# EAGLE design 15321^3 (EAGLE 7.6.0)
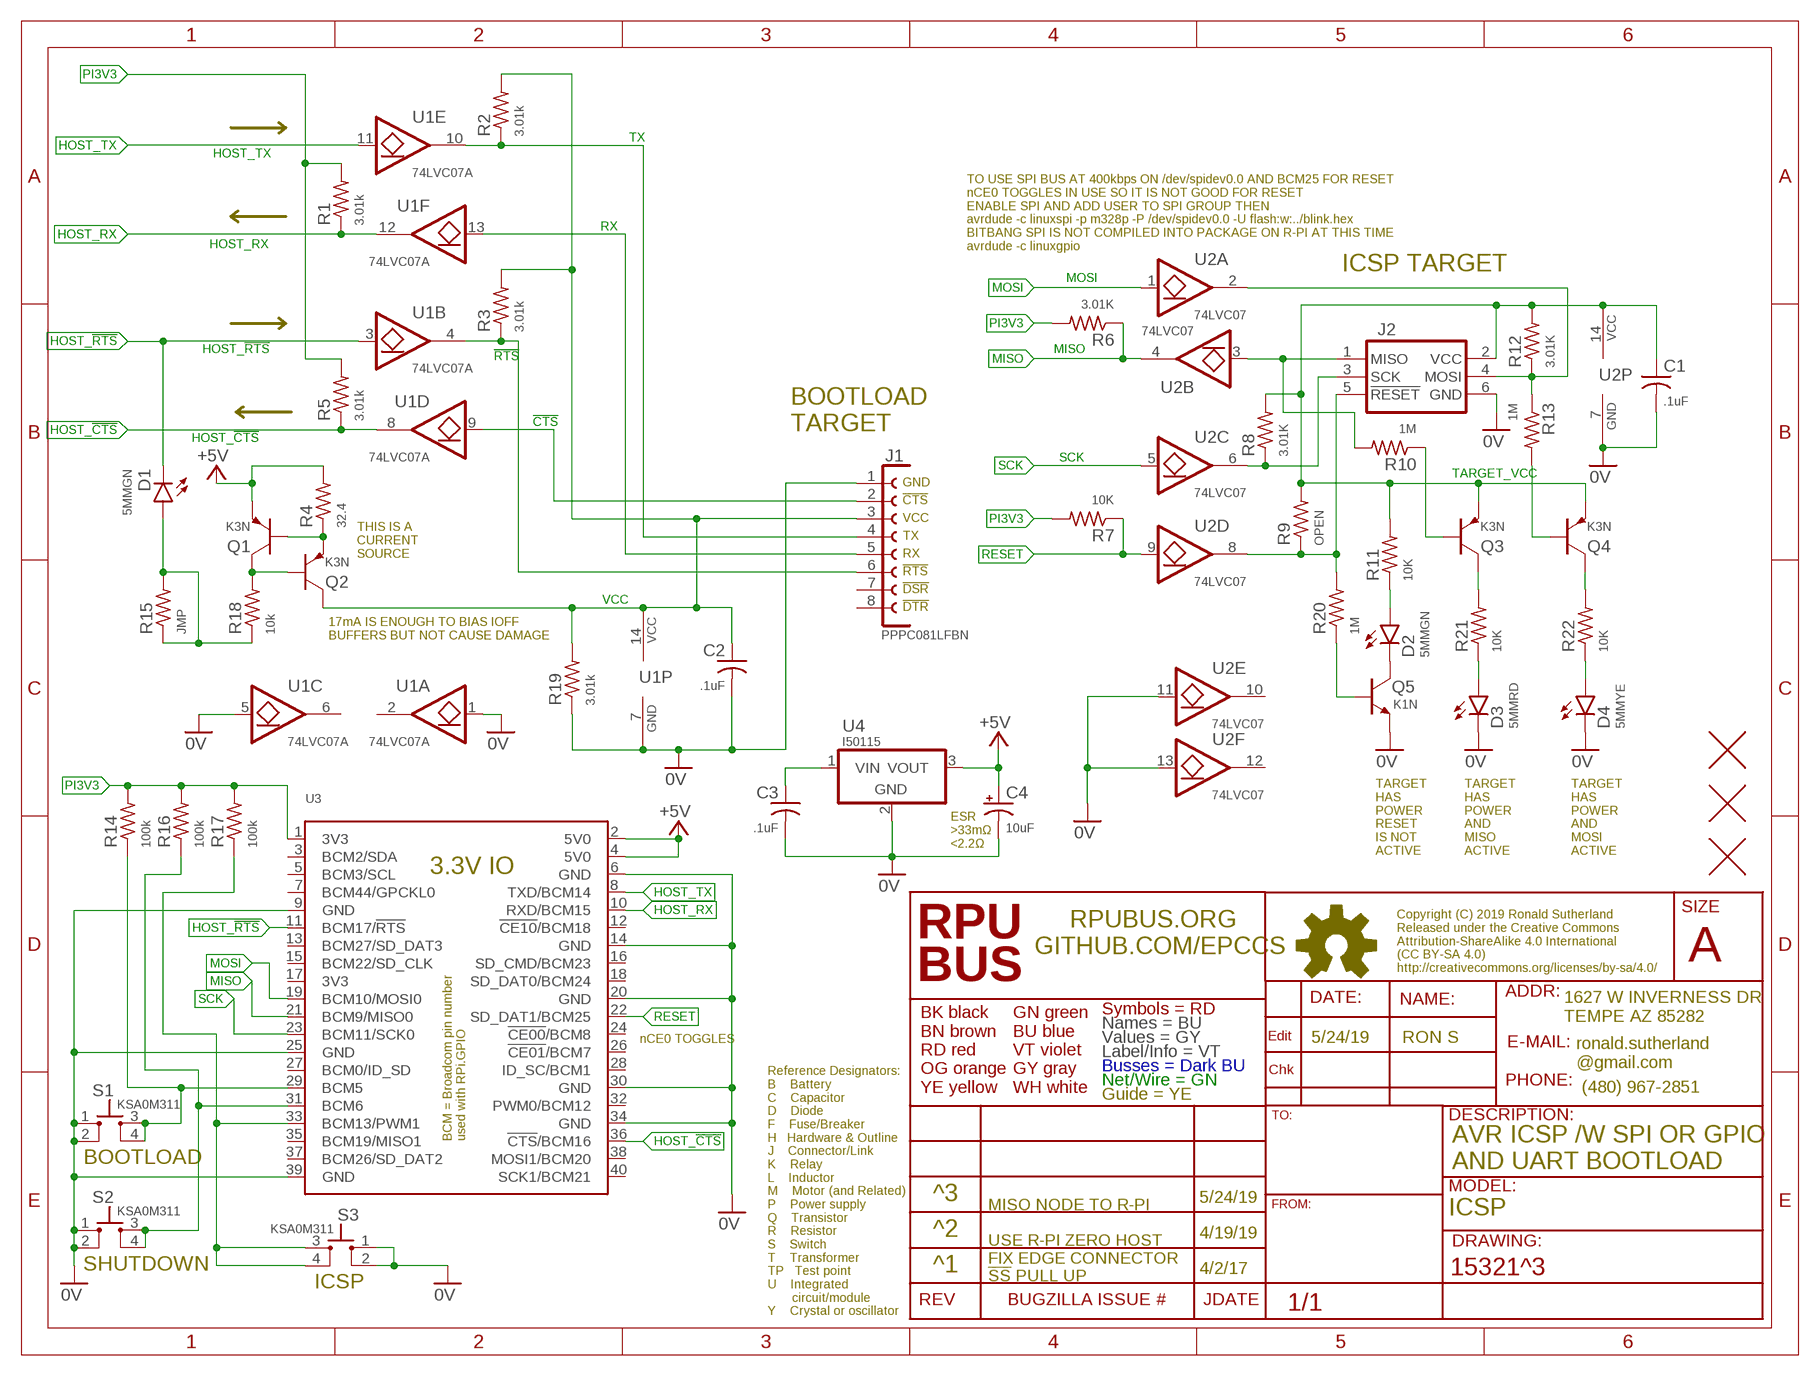
[diagram p0: schematic, sheet 1]

## Parts
C1  .1uF  CC0603A  [C0603(1608)]
C2  .1uF  CC0603A  [C0603(1608)]
C3  .1uF  CC0603A  [C0603(1608)]
C4  10uF  CT1206  [3216]
D1  5MMGN  LED5MM  [LED5MM]
D2  5MMGN  LED5MM  [LED5MM]
D3  5MMRD  LED5MM  [LED5MM]
D4  5MMYE  LED5MM  [LED5MM]
J1  PPPC081LFBN  F1X8  [F1X8]
J2  ISP-SPIEDG  [ISP-EDG]
Q1  K3N  PNPSOT23  [SOT23]
Q2  K3N  PNPSOT23  [SOT23]
Q3  K3N  PNPSOT23  [SOT23]
Q4  K3N  PNPSOT23  [SOT23]
Q5  K1N  NPNSOT23  [SOT23]
R1  3.01k  R0805  [C0805(2012)]
R2  3.01k  R0805  [C0805(2012)]
R3  3.01k  R0805  [C0805(2012)]
R4  32.4  R0805  [C0805(2012)]
R5  3.01k  R0805  [C0805(2012)]
R6  3.01K  R0805  [C0805(2012)]
R7  10K  R0805  [C0805(2012)]
R8  3.01K  R0805  [C0805(2012)]
R9  OPEN  R0805  [C0805(2012)]
R10  1M  R0805  [C0805(2012)]
R11  10K  R0805  [C0805(2012)]
R12  3.01K  R0805  [C0805(2012)]
R13  1M  R0805  [C0805(2012)]
R14  100k  R0805  [C0805(2012)]
R15  JMP  R0805  [C0805(2012)]
R16  100k  R0805  [C0805(2012)]
R17  100k  R0805  [C0805(2012)]
R18  10k  R0805  [C0805(2012)]
R19  3.01k  R0805  [C0805(2012)]
R20  1M  R0805  [C0805(2012)]
R21  10K  R0805  [C0805(2012)]
R22  10K  R0805  [C0805(2012)]
S1  KSA0M311  [0M311]
S2  KSA0M311  [0M311]
S3  KSA0M311  [0M311]
U1  74LVC07A  7407D  [14SOIC]
U2  74LVC07  7407D  [14SOIC]
U3  RPI-ZERO  [RASPI_ZERO_H40PIN]
U4  I50115  OKI-78SR-H  [OKI-78SR-H]
U$2  FIDUCIAL1.27  [FIDUCIAL-1.27]
U$3  FIDUCIAL1.27  [FIDUCIAL-1.27]
U$4  FIDUCIAL1.27  [FIDUCIAL-1.27]

## Nets
0V: C1.2 C2.2 C3.2 C4.- D3.K D4.K J1.1 J2.6(GND) Q5.E R19.1 S1.1 S1.2 S2.1 S2.2 S3.1 S3.2 U1.1(A:I) U1.5(C:I) U1.7(P:GND) U2.7(P:GND) U2.11(E:I) U2.13(F:I) U3.6(GND) U3.9(GND) U3.14(GND) U3.20(GND) U3.25(GND) U3.30(GND) U3.34(GND) U3.39(GND) U4.2(GND)
!CTS: J1.2 U1.9(D:I)
!RST: J2.5(!RESET) R9.1 R20.2 U2.8(D:O)
!RTS: J1.6 R3.1 U1.4(B:O)
+5V: C4.+ Q1.E R4.2 U3.2(5V0) U3.4(5V0) U4.3(VOUT)
HOST_!CTS: R5.1 U1.8(D:O) U3.36(!CTS!/BCM16)
HOST_!RTS: D1.K U1.3(B:I) U3.11(BCM17/!RTS!)
HOST_RX: R1.1 U1.12(F:O) U3.10(RXD/BCM15)
HOST_TX: U1.11(E:I) U3.8(TXD/BCM14)
MISO: R6.1 U2.4(B:O) U3.21(BCM9/MISO0)
MOSI: U2.1(A:I) U3.19(BCM10/MOSI0)
N$1: J2.3(SCK) R8.1 U2.6(C:O)
N$2: D4.A R22.1
N$3: J2.1(MISO) R10.2 U2.3(B:I)
N$4: J2.4(MOSI) R12.1 R13.1 U2.2(A:O)
N$5: Q4.C R22.2
N$6: D3.A R21.1
N$7: Q3.C R21.2
N$8: Q1.B Q2.E R4.1
N$9: Q1.C Q2.B R18.2
N$10: D1.A R15.1 R15.2 R18.1
N$11: Q5.B R20.1
N$12: D2.K Q5.C
N$13: R14.1 S1.3 S1.4 U3.29(BCM5)
N$14: R16.1 S2.3 S2.4 U3.31(BCM6)
N$15: R17.1 S3.3 S3.4 U3.33(BCM13/PWM1)
N$16: D2.A R11.1
N$17: Q4.B R13.2
N$18: Q3.B R10.1
PI3V3: R1.2 R5.2 R6.2 R7.2 R14.2 R16.2 R17.2 U3.1(3V3)
RESET: R7.1 U2.9(D:I) U3.22(SD_DAT1/BCM25)
RX: J1.5 U1.13(F:I)
SCK: U2.5(C:I) U3.23(BCM11/SCK0)
TARGET_VCC: C1.1 J2.2(VCC) Q3.E Q4.E R8.2 R9.2 R11.2 R12.2 U2.14(P:VCC)
TX: J1.4 R2.1 U1.10(E:O)
VCC: C2.1 J1.3 Q2.C R2.2 R3.2 R19.2 U1.14(P:VCC)
VIN: C3.1 U4.1(VIN)
Unconnected: J1.7 J1.8 U1.2(A:O) U1.6(C:O) U2.10(E:O) U2.12(F:O) U3.3(BCM2/SDA) U3.5(BCM3/SCL) U3.7(BCM44/GPCKL0) U3.12(!CE10!/BCM18) U3.13(BCM27/SD_DAT3) U3.15(BCM22/SD_CLK) U3.16(SD_CMD/BCM23) U3.17(3V3) U3.18(SD_DAT0/BCM24) U3.24(!CE00!/BCM8) U3.26(!CE01!/BCM7) U3.27(BCM0/ID_SD) U3.28(ID_SC/BCM1) U3.32(PWM0/BCM12) U3.35(BCM19/MISO1) U3.37(BCM26/SD_DAT2) U3.38(MOSI1/BCM20) U3.40(SCK1/BCM21)

## Notes on the sheet
- TO USE SPI BUS AT 400kbps ON /dev/spidev0.0 AND BCM25 FOR RESET
  nCE0 TOGGLES IN USE SO IT IS NOT GOOD FOR RESET
  ENABLE SPI AND ADD USER TO SPI GROUP THEN
  avrdude -c linuxspi -p m328p -P /dev/spidev0.0 -U flash:w:../blink.hex 
  BITBANG SPI IS NOT COMPILED INTO PACKAGE ON R-PI AT THIS TIME
  avrdude -c linuxgpio
- ICSP TARGET
- BOOTLOAD
  TARGET
- GND
- !CTS
- VCC
- TX
- THIS IS A 
  CURRENT 
  SOURCE
- RX
- !RTS
- !DSR
- !DTR
- 17mA IS ENOUGH TO BIAS IOFF 
  BUFFERS BUT NOT CAUSE DAMAGE
- ESR
  >33mΩ
  <2.2Ω
- TARGET
  HAS
  POWER
  RESET 
  IS NOT 
  ACTIVE
- TARGET
  HAS
  POWER
  AND
  MISO 
  ACTIVE
- TARGET
  HAS
  POWER
  AND
  MOSI
  ACTIVE
- nCE0 TOGGLES | 5/24/19 | RON S
- BOOTLOAD
- AVR ICSP /W SPI OR GPIO
  AND UART BOOTLOAD
- ^3 | 5/24/19
- MISO NODE TO R-PI
- ICSP
- ^2 | 4/19/19
- USE R-PI ZERO HOST
- SHUTDOWN | ^1 | 4/2/17
- FIX EDGE CONNECTOR
  !SS! PULL UP
- ICSP

## Library data of the parts
C1-C3 = C-C:C: CAPACITOR Symbol
C4 = C-T:CT: Tantalum Electrolytic Capacitor
D1-D4 = D-LED:LED: LED 120120WH [CREE,XHGAWT-00-0000-00000HXE1] LED WHITE 6500K 150LUM-W120120
J1 = J-HDR2.54mm:F1X8: FEMALE HEADER 8POS
J2 = U-AVR:ISP-SPI: AVR ISP thru SPI In-System Programming uses the target Atmel AVR’s internal SPI (Serial Peripheral Interface) to download code into the flash and EEPROM memories. It is not a debugging interface. When designing an application PCB which includes an AVR with the SPI interface, this pinout should be used. Sparkfun SKU: BOB-08508
Q1-Q4 = Q-PNP:PNP: BJT NPN General Purpose Amplifier
Q5 = Q-NPN:NPN: BJT NPN General Purpose Amplifier
R1-R22 = R-C:R: Resiistor American-style symbol
S1-S3 = S-Tactile:KSA: KSA0M311 [C&K,KSA0M311LFT] SWITCH TACTILE SEALED SPST-NO 50MA 32V
U1 U2 = U-7400:74*07: HEX BUFFER, OPEN DRAIN/COLLECTOR 74LVC07A [DIODES,74LVC07AS14-13] LOGIC BUFFER OPEN DRAIN 14SOIC
U3 = U-Pi:RPI-ZERO: Raspberry Pi Zero https://pinout.xyz/ NOTE: WiFi is needed see https://www.kickstarter.com/projects/1991736672/iot-hat-for-raspberry-pi-a-must-have-for-pi-zero
U4 = P-DCDC:OKI-78SR: OKI-78SR OKI-78SR-5/1.5-W36H-C 5V@1.5A Horizontal Mount OKI-78SR-5/1.5-W36-C 5V@1.5A Vert Mount OKI-78SR-3.3/1.5-W36H-C 3.3V@1.5A Horizontal Mount OKI-78SR-3.3/1.5-W36-C 3.3V@1.5A Vert Mount Murata Power Solutions 7 to 36 VDC input range need to verify pinout
U$2-U$4 = H-Fiducial:FIDUCIAL: Fiducial Alignment Points Various fiducial points for machine vision alignment.

## Net classes
0 default: width 0.178 mm, drill 0.33 mm

## Board
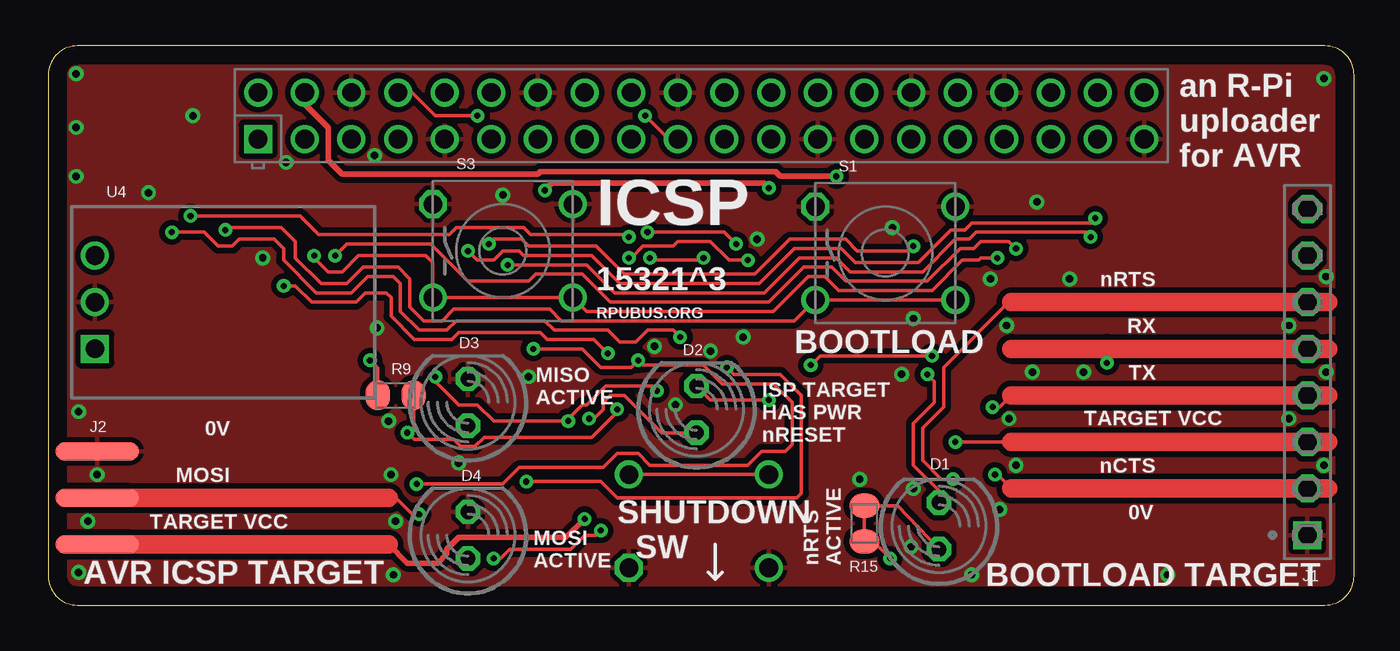
[diagram p1: board, top side]
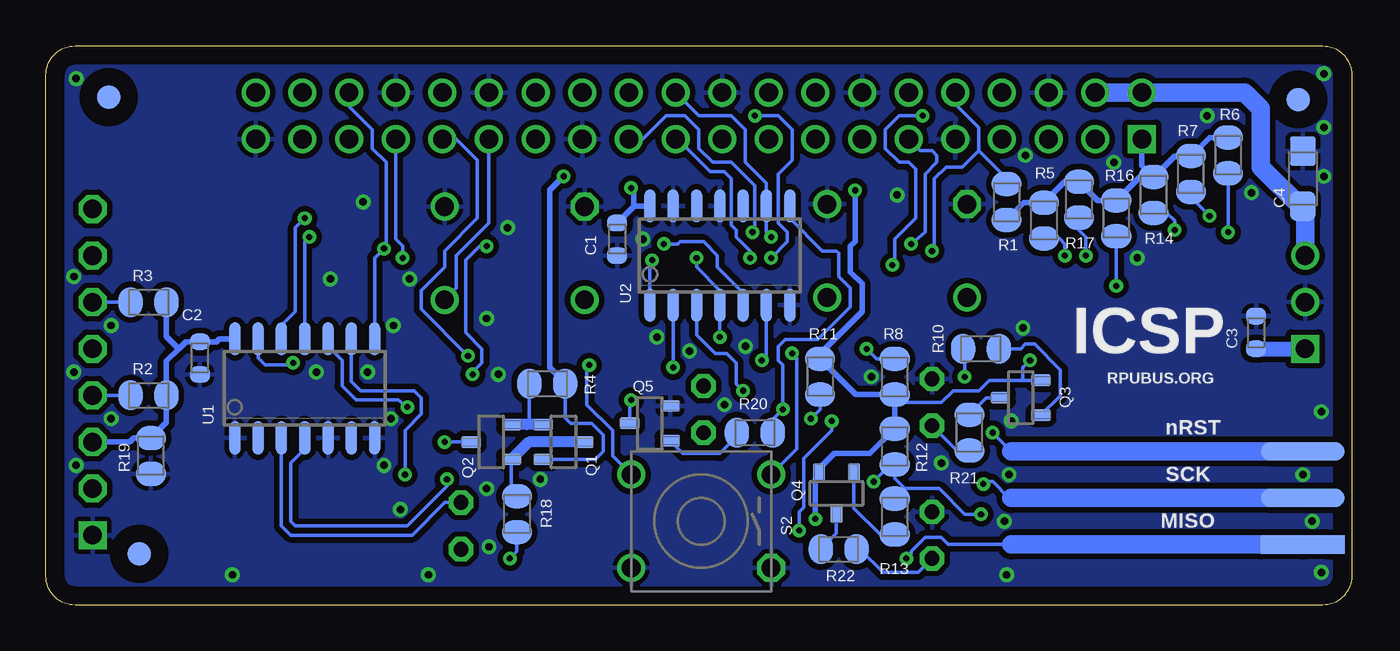
[diagram p2: board, bottom side, seen from below]

Size 71.12 x 30.48 mm. Coordinates in mm from the lower left corner, seen from the top.
Outline: 0,28.89 0,1.59 arc90 1.59,0 69.53,0 arc90 71.12,1.59 71.12,28.89 arc90 69.53,30.48 1.59,30.48 arc90 0,28.89
Copper layers (1*16): Top 0.035mm / dielectric 1.5mm / Bottom 0.035mm
Design rules "default *": minimum track width 10mil, minimum drill 13mil, track to track 10mil, track to pad 10mil, pad to pad 10mil, via to via 10mil, smd to smd 8mil, copper to edge 40mil, drill to drill 8mil, minimum pad ring 10mil, minimum via ring 8mil, stop-mask expansion 4mil, vias tented up to drill 17mil, thermal gap 10mil

### Footprints (pad centres in the part's own frame; a part is rotated, then mirrored left to right if it is on the bottom)
C0603(1608) = smd 0.898 x 1.1: 1 -0.889,0; 2 0.889,0
3216 = smd 1.6 x 1.4: + -1.5,0; - 1.5,0
LED5MM = drill 0.813 octagon: A -1.27,0; K 1.27,0
F1X8 = drill 1.016 square: 1 0,0 | drill 1.016 octagon: 2 2.54,0; 3 5.08,0; 4 7.62,0; 5 10.16,0; 6 12.7,0; 7 15.24,0; 8 17.78,0
ISP-EDG = smd 1.016 x 4.572 bottom: 1 -2.54,2.286; 3 0,2.286; 5 2.54,2.286 | smd 1.016 x 4.572: 2 -2.54,2.286; 4 0,2.286; 6 2.54,2.286
SOT23 = smd 0.65 x 1.06: B -0.95,-1.1; C 0,1.1; E 0.95,-1.1
C0805(2012) = smd 1.321 x 1.651: 1 -0.977,0; 2 0.977,0
0M311 = drill 1.016 octagon: 1 -3.81,2.54 | drill 1.016: 2 3.81,2.54; 3 -3.81,-2.54; 4 3.81,-2.54
14SOIC = smd 0.6 x 1.8: 1 -3.81,-2.7; 2 -2.54,-2.7; 3 -1.27,-2.7; 4 0,-2.7; 5 1.27,-2.7; 6 2.54,-2.7; 7 3.81,-2.7; 8 3.81,2.7; 9 2.54,2.7; 10 1.27,2.7; 11 0,2.7; 12 -1.27,2.7; 13 -2.54,2.7; 14 -3.81,2.7
RASPI_ZERO_H40PIN = drill 1.016 square: 1 0,0 | drill 1.016: 2 0,2.54; 3 2.54,0; 4 2.54,2.54; 5 5.08,0; 6 5.08,2.54; 7 7.62,0; 8 7.62,2.54; 9 10.16,0; 10 10.16,2.54; 11 12.7,0; 12 12.7,2.54; 13 15.24,0; 14 15.24,2.54; 15 17.78,0; 16 17.78,2.54; 17 20.32,0; 18 20.32,2.54; 19 22.86,0; 20 22.86,2.54; 21 25.4,0; 22 25.4,2.54; 23 27.94,0; 24 27.94,2.54; 25 30.48,0; 26 30.48,2.54; 27 33.02,0; 28 33.02,2.54; 29 35.56,0; 30 35.56,2.54; 31 38.1,0; 32 38.1,2.54; 33 40.64,0; 34 40.64,2.54; 35 43.18,0; 36 43.18,2.54; 37 45.72,0; 38 45.72,2.54; 39 48.26,0; 40 48.26,2.54
OKI-78SR-H = drill 1.016 square: 1 0,0 | drill 1.016: 2 -2.54,0; 3 -5.08,0
FIDUCIAL-1.27 = smd 1.27 x 1.27: 1 0,0

### Placement (x,y rotation side)
C1  40.01,19.94 270 bottom
C2  62.74,13.46 270 bottom
C3  5.21,14.86 90 bottom
C4  2.67,23.24 90 bottom
D1  48.51,4.32 90 top
D2  35.31,10.67 90 top
D3  22.86,11.05 90 top
D4  22.86,3.81 90 top
J1  68.58,3.81 90 top
J2  4.95,5.84 90 top
Q1  42.93,8.89 270 bottom
Q2  46.86,8.89 90 bottom
Q3  18.03,11.3 90 bottom
Q4  28.07,6.1 180 bottom
Q5  38.23,9.91 90 bottom
R1  18.8,21.97 270 bottom
R2  65.53,11.43 0 bottom
R3  65.53,16.51 0 bottom
R4  43.81,12.06 0 bottom
R5  16.76,20.95 90 bottom
R6  6.73,24.51 90 bottom
R7  8.76,23.5 90 bottom
R8  24.89,12.45 270 bottom
R9  18.92,11.43 180 top
R10  20.19,13.97 180 bottom
R11  28.96,12.45 90 bottom
R12  24.89,8.64 90 bottom
R13  24.89,4.83 270 bottom
R14  10.79,22.35 90 bottom
R15  44.45,4.45 90 top
R16  12.83,21.08 90 bottom
R17  14.86,22.1 90 bottom
R18  45.47,4.95 90 bottom
R19  65.41,8.13 90 bottom
R20  32.51,9.4 0 bottom
R21  20.83,9.4 90 bottom
R22  27.94,3.05 180 bottom
S1  45.59,19.18 0 top
S2  35.43,4.57 180 bottom
S3  24.77,19.3 0 top
U1  57.02,11.81 0 bottom
U2  34.42,19.05 0 bottom
U3  11.43,25.4 0 top
U4  2.54,13.97 270 top
U$2  2.92,27.56 0 bottom
U$3  67.69,27.69 0 bottom
U$4  66.04,2.79 0 bottom

### Tracks (layer width: path | path; a pad name or v marks a point on that pad's centre or on a via)
0V  (via drill 0.41)
  other vias: 60.96,1.65 1.65,1.78 2.67,7.11 69.47,7.62 67.56,10.16 69.6,12.7 67.56,15.24 69.6,17.91 52.2,15.24 53.59,12.7 56.39,12.7 52.7,7.62 52.32,10.16 55.63,17.78 2.16,4.57 18.54,10.03 1.52,28.96 69.47,28.7 17.91,15.11 11.68,18.92 5.46,22.48 7.87,26.67 12.95,24.13 17.78,24.51 24.77,22.35 33.02,14.1 34.16,10.92 22.35,7.75 18.67,7.11 18.92,4.57 18.8,1.65 44.2,6.86 46.99,3.17 51.82,5.21 50.29,1.65 46.48,12.57 47.12,15.62 51.31,17.78 45.97,20.57 53.85,21.97 36.07,13.84 37.85,14.61 47.12,6.35 26.16,12.45 38.61,19.94 1.65,10.54 1.52,26.04 1.52,23.37
  pour Bottom (isolate 0.305): 0,30.48 71.12,30.48 71.12,0 0,0
  pour Top (isolate 0.305): 0,30.48 71.12,30.48 71.12,0 0,0
!CTS  (via drill 0.33)
  Top 0.203: v51.56,7.11 51.69,7.11 52.45,6.35
  Top 1.016: 52.45,6.35 J1.2 69.72,6.35
  Bottom 0.203: U1.9 54.48,12.19 53.98,11.68 51.05,11.68 50.67,11.3 50.67,10.41 51.56,9.53 v51.56,7.11
!RST  (via drill 0.33)
  Top 0.203: v30.99,10.67 30.99,10.54 29.59,9.14 23.75,9.14 23.24,8.64 22.48,8.64 22.1,9.02 19.94,9.02 v19.56,9.4 19.9,9.74 R9.1
  Bottom 0.203: R20.2 31.54,10.12 v30.99,10.67 30.99,13.08 31.24,13.34 31.24,14.1 30.86,14.48 29.08,14.48 27.3,16.26 27.3,17.27 27.94,17.91 27.94,19.18 28.07,19.3 28.83,19.3 30.61,21.08 U2.8 | v19.56,9.4 18.54,8.38
  Bottom 1.016: 1.27,8.38 J2.5 18.54,8.38
!RTS  (via drill 0.33)
  Top 0.203: v49.28,6.86 48.64,6.86 47.62,7.87 47.62,9.65 48.77,10.79 48.77,12.95 52.32,16.51 52.45,16.51
  Top 1.016: 52.45,16.51 J1.6 69.72,16.51
  Bottom 0.203: R3.1 J1.6 | U1.4 57.02,8.51 57.78,7.75 57.78,4.57 57.53,4.32 51.44,4.32 49.28,6.48 v49.28,6.86
+5V  (via drill 0.33)
  Top 0.305: U3.4 13.97,27.3 15.24,26.04 15.24,24.26 16,23.5 26.67,23.5 26.8,23.62 39.62,23.62 39.88,23.37 v42.93,23.37
  Bottom 0.203: Q1.E 41.21,7.94 40.77,8.38 40.77,9.27 41.4,9.91 42.55,9.91 42.84,10.2 R4.2
  Bottom 0.305: v42.93,23.37 43.69,22.61 43.69,12.95 42.84,12.1 R4.2
  Bottom 1.016: U4.3 2.54,21.61 C4.+ 2.82,21.74 4.95,23.88 4.95,27.05 5.84,27.94 U3.2 U3.4
HOST_!CTS  (via drill 0.33)
  Top 0.203: v15.62,19.05 16.26,19.68 20.83,19.68 22.86,17.65 26.16,17.65 26.54,18.03 29.08,18.03 30.61,16.51 39.24,16.51 41.15,18.41 42.67,18.41 43.43,17.65 47.88,17.65 49.66,19.43 50.42,19.43 50.8,19.81 52.32,19.81 v52.7,19.43
  Bottom 0.203: R5.1 15.91,19.98 15.62,19.68 v15.62,19.05 | U1.8 53.21,18.92 v52.7,19.43 52.58,19.56 52.58,24.13 53.34,24.89 53.34,25.91 54.61,27.18 U3.36
HOST_!RTS  (via drill 0.33)
  Top 0.203: v24,19.68 24.26,19.94 25.78,19.94 26.16,19.56 29.84,19.56 31.37,18.03 38.48,18.03 40.39,19.94 43.43,19.94 44.07,19.3 46.86,19.3 v47.12,19.56 | v47.88,12.57 48.26,12.19 48.26,11.05 47.12,9.91 47.12,7.62 48.51,6.22 D1.K
  Bottom 0.203: U1.3 58.29,4.32 57.78,3.81 51.18,3.81 49.4,5.59 D1.K | U3.11 23.5,24.77 22.86,24.77 22.61,24.51 22.61,24.13 23.24,23.5 23.24,20.32 v24,19.68 | v47.12,19.56 47.5,19.56 48.26,18.8 48.26,14.86 47.37,13.97 47.37,13.21 47.88,12.7 v47.88,12.57
HOST_RX  (via drill 0.33)
  Top 0.203: v57.02,21.08 56.77,20.83 50.29,20.83 49.91,20.45 49.15,20.45 47.37,18.67 43.94,18.67 43.18,19.43 40.64,19.43 38.73,17.53 31.11,17.53 29.59,19.05 25.91,19.05 25.65,19.3 24.77,19.3 24.26,18.8 23.37,18.8 v22.86,19.3
  Bottom 0.203: R1.1 18.8,23.24 20.32,24.77 | 20.32,24.77 20.32,26.04 21.59,27.3 U3.10 | U1.12 58.29,15.24 57.53,16 57.53,20.57 v57.02,21.08 | v22.86,19.3 22.73,19.3 22.73,23.24 22.1,23.88 21.21,23.88 20.32,24.77
HOST_TX  (via drill 0.33)
  Top 0.203: v56.77,20.07 56.52,20.32 50.55,20.32 50.16,19.94 49.4,19.94 47.62,18.16 43.69,18.16 42.93,18.92 40.89,18.92 38.99,17.02 30.86,17.02 29.34,18.54 v25.02,18.54 | U3.8 19.81,27.94 21.08,26.67 v23.37,26.67
  Bottom 0.203: U1.11 57.02,19.81 v56.77,20.07 | v23.37,26.67 24.64,26.67 25.4,25.91 25.4,24.89 24.64,24.13 24.13,24.13 23.75,23.75 23.75,21.08 24.89,19.94 24.89,18.67 v25.02,18.54
MISO  (via drill 0.33)
  Top 0.203: v6.73,20.32 8.51,20.32 9.27,19.56 10.03,19.56 10.41,19.94 12.32,19.94 12.83,19.43 12.83,18.8 14.61,17.02 16.51,17.02 17.4,17.91 18.8,17.91 19.18,17.53 19.18,16 20.19,14.99 21.72,14.99 22.23,15.49 27.05,15.49 27.56,14.99 30.48,14.99 31.11,14.35 32,14.35 32.64,14.99 34.04,14.99 v34.42,14.61 | v32.77,18.92 32.89,18.8 35.56,18.8 v35.69,18.92
  Bottom 0.203: R6.1 v6.73,20.32 | v34.42,14.61 U2.4 34.42,17.14 35.69,18.41 v35.69,18.92 | U3.21 36.7,25.4 34.92,23.62 34.16,23.62 33.78,23.24 33.78,20.7 33.53,20.45 33.53,20.07 32.77,19.3 v32.77,18.92
MOSI  (via drill 0.33)
  Top 0.203: v31.62,18.92 31.75,18.92 32.38,19.56 34.04,19.56 34.29,19.81 36.07,19.81 37.08,18.8 v38.1,18.8 | U3.19 33.78,25.4 v32.51,26.67
  Bottom 0.203: v38.1,18.8 38.23,18.67 U2.1 | v32.51,26.67 31.24,26.67 30.48,25.91 30.48,24.26 31.24,23.5 31.24,20.83 30.73,20.32 30.73,19.81 v31.62,18.92
N$1  (via drill 0.33)
  Top 0.203: v20.07,6.6 24.77,6.6 25.65,7.49 30.23,7.49 30.99,8.26 32.13,8.26 32.77,7.62 38.1,7.62 38.86,8.38 40.13,8.38 40.51,8.76 40.51,11.05 39.5,12.06 36.7,12.06 35.69,13.08 32.38,13.08 v32.13,13.34 31.75,12.95 30.1,12.95 29.08,13.97 v26.42,13.97
  Bottom 0.203: 18.54,5.84 18.67,5.84 19.56,6.73 19.94,6.73 v20.07,6.6 | v32.13,13.34 31.88,13.59 U2.6 | R8.1 25.87,13.42 v26.42,13.97
  Bottom 1.016: 1.27,5.84 J2.3 18.54,5.84
N$2
  Bottom 0.203: R22.1 26.8,3.05 25.53,1.78 23.62,1.78 D4.A
N$3  (via drill 0.33)
  Top 0.203: v24.26,2.54 24.64,2.54 25.15,3.05 28.45,3.05 29.21,3.81 29.84,3.81 v30.1,4.06 | v21.08,12.45 21.08,12.19 22.35,10.92 23.37,10.92 24.26,10.03 v28.32,10.03 28.32,10.16 29.08,10.92 29.34,10.92 30.35,11.94 32.89,11.94 v33.15,11.68
  Bottom 0.203: 18.54,3.3 21.97,3.3 22.35,3.68 23.24,3.68 24,2.92 24,2.79 v24.26,2.54 | v30.1,4.06 30.1,5.08 29.84,5.33 29.84,8 28.32,9.53 v28.32,10.03 | v21.08,12.45 21.08,13.88 R10.2 | v33.15,11.68 33.53,12.06 33.53,13.21 34.04,13.72 34.67,13.72 35.69,14.73 U2.3
  Bottom 1.016: 1.27,3.3 J2.1 18.54,3.3
N$4  (via drill 0.33)
  Top 0.203: 18.54,5.84 18.92,5.84 19.81,4.95 v20.19,4.95 | v26.04,6.73 30.1,6.73 30.99,5.84 40.77,5.84 41.02,6.1 41.02,11.43 39.88,12.57 37.34,12.57 v36.96,12.95
  Top 1.016: 1.27,5.84 J2.4 18.54,5.84
  Bottom 0.203: v20.19,4.95 21.08,4.95 22.48,6.35 24.34,6.35 | 24.34,6.35 R13.1 | 24.34,6.35 24.89,6.9 R12.1 25.11,7.66 v26.04,6.73 | v36.96,12.95 U2.2
N$5
  Bottom 0.203: Q4.C 28.07,3.9 R22.2
N$6
  Bottom 0.203: R21.1 21.5,8.42 D3.A
N$7
  Bottom 0.203: Q3.C 19.9,11.3 R21.2
N$8
  Bottom 0.203: R4.1 44.79,10.01 44.96,9.84
  Bottom 0.61: Q1.B 44.96,9.84 Q2.E
N$9
  Bottom 0.203: Q2.B 45.76,6.23 R18.2
  Bottom 0.61: Q1.C 44.81,8.89 Q2.B
N$10  (via drill 0.33)
  Top 0.203: v45.85,2.54 44.92,3.47 R15.1 R15.2 46.27,5.42 D1.A
  Bottom 0.203: R18.1 45.47,2.92 v45.85,2.54
N$11
  Bottom 0.203: R20.1 33.49,9.18 34.42,8.26 36.43,8.26 Q5.B
N$12  (via drill 0.33)
  Top 0.203: v39.24,11.18 36.07,11.18 D2.K
  Bottom 0.203: Q5.C 39.33,11.09 v39.24,11.18
N$13  (via drill 0.33)
  Top 0.203: v9.65,20.45 9.78,20.57 12.7,20.57 13.46,19.81 13.46,18.92 14.86,17.53 16.26,17.53 17.14,18.41 19.05,18.41 19.68,17.78 19.68,16.26 20.45,15.49 21.46,15.49 22.1,16.13 27.3,16.13 27.94,15.49 40.64,15.49 S1.3 S1.4
  Bottom 0.203: R14.1 10.07,21.38 9.65,20.95 v9.65,20.45 | U3.29 46.99,20.83 48.77,19.05 48.77,17.27 S1.4
N$14  (via drill 0.33)
  Top 0.203: v12.83,17.4 13.46,17.4 14.35,16.51 16.76,16.51 17.27,17.02 18.41,17.02 18.67,16.76 18.67,15.75 19.94,14.48 21.97,14.48 22.35,14.86 26.8,14.86 27.18,14.48 29.72,14.48 v30.48,13.72 | S2.3 S2.4 | v48.13,13.59 42.04,13.59 v41.53,13.08
  Bottom 0.203: R16.1 v12.83,17.4 | v30.48,13.72 30.23,13.46 30.23,8.51 S2.3 | U3.31 48.77,25.4 47.62,24.26 47.62,21.08 49.4,19.3 49.4,18.41 50.67,17.14 50.67,16.13 v48.13,13.59 | v41.53,13.08 41.66,12.95 41.66,10.92 40.26,9.53 40.26,8.13 S2.4
N$15  (via drill 0.33)
  Top 0.203: v51.69,18.92 50.8,18.92 50.67,18.8 49.78,18.8 48.13,17.14 43.05,17.14 42.29,17.91 41.4,17.91 39.5,16 29.34,16 S3.4 S3.3 20.95,18.67 20.57,19.05 16.89,19.05 16,18.16 15.24,18.16 14.48,18.92 v14.48,19.05
  Bottom 0.203: R17.1 14.86,20.45 14.48,20.07 v14.48,19.05 | v51.69,18.92 51.69,19.56 52.07,19.94 U3.33
N$16  (via drill 0.33)
  Top 0.203: D2.A 33.4,9.4 31.37,11.43 30.61,11.43 30.23,11.05 30.23,10.67 29.72,10.16 v29.46,10.16
  Bottom 0.203: v29.46,10.16 28.96,10.67 R11.1
N$17
  Bottom 0.203: R13.2 25.69,3.85 27.12,5.27 Q4.B
N$18
  Bottom 0.203: 19.18,13.97 R10.1 18.03,13.97 17.78,14.22 17.27,14.22 15.88,12.83 15.88,11.41 Q3.B
PI3V3
  Bottom 0.305: R6.2 7.75,25.49 R7.2 9.65,24.47 R14.2 | U3.1 11.43,23.96 R14.2 | R14.2 11.56,23.33 R16.2 13.84,22.06 R17.2 15.62,23.07 R5.2 17.86,21.93 R1.2
RESET  (via drill 0.33)
  Top 0.203: v7.75,21.21 13.72,21.21 14.73,20.19 21.84,20.19 22.23,20.57 25.91,20.57 26.29,20.19 31.5,20.19 v31.62,20.07
  Bottom 0.203: R7.1 8.76,22.23 v7.75,21.21 | v31.62,20.07 31.88,20.32 U2.9 31.88,22.99 33.02,24.13 33.02,25.91 33.78,26.67 35.56,26.67 U3.22
RX  (via drill 0.33)
  Top 0.203: v57.66,13.21 57.66,13.97
  Top 1.016: 52.45,13.97 57.66,13.97 J1.5 69.72,13.97
  Bottom 0.203: U1.13 59.56,13.46 59.18,13.08 57.78,13.08 v57.66,13.21
SCK  (via drill 0.33)
  Top 0.203: v37.47,19.68 36.83,20.32 v32.64,20.32
  Bottom 0.203: U2.5 33.15,17.02 34.54,18.41 34.54,19.05 35.31,19.81 36.58,19.81 36.7,19.68 v37.47,19.68 | v32.64,20.32 32.51,20.7 32.51,22.86 33.78,24.13 34.8,24.13 35.56,24.89 35.56,25.91 36.32,26.67 37.34,26.67 38.61,25.4 U3.23
TARGET_VCC  (via drill 0.33)
  Top 0.203: R9.2 17.95,12.91 v17.53,13.34
  Top 0.305: 18.54,3.3 19.56,2.29 21.21,2.29 21.72,2.79 21.72,3.05 22.35,3.68 28.19,3.68 v29.21,4.7 | v27.05,22.61 27.43,22.99 38.99,22.99 v39.24,22.73
  Top 1.016: 1.27,3.3 J2.2 18.54,3.3
  Bottom 0.203: Q4.E 28.89,7.56 | Q3.E 18.03,12.25 | 18.03,12.25 19.75,12.25 20.32,11.68 21.72,11.68 22.35,11.05 24.47,11.05 R8.2 | v17.53,13.34 17.91,12.95 17.91,12.38 18.03,12.25
  Bottom 0.305: 28.89,7.56 28.19,8.26 26.25,8.26 R12.2 R8.2 27,11.47 R11.2 28.96,13.72 26.67,16 26.67,17.53 27.3,18.16 27.3,19.56 27.05,19.81 v27.05,22.61 | v29.21,4.7 29.21,6.88 Q4.E | C1.1 39.08,21.75 | U2.14 39.08,21.75 | v39.24,22.73 39.12,22.61 39.12,21.78 39.08,21.75
TX  (via drill 0.33)
  Top 0.203: v51.44,10.79 51.82,10.79 52.45,11.43
  Top 1.016: 52.45,11.43 J1.4 69.72,11.43
  Bottom 0.203: U1.10 55.75,14.1 54.99,13.34 54.99,11.94 54.23,11.18 51.94,11.18 v51.44,10.79 | R2.1 J1.4
VCC  (via drill 0.33)
  Top 0.203: v49.4,8.89 52.45,8.89
  Top 1.016: 52.45,8.89 J1.3 69.72,8.89
  Bottom 0.203: Q2.C v49.4,8.89
  Bottom 0.305: J1.3 66.55,8.89 66.33,9.11 R19.2 64.56,9.96 R2.2 64.56,13.3 63.88,13.97 | 63.88,13.97 63.5,14.35 C2.1 61.85,14.35 61.69,14.51 U1.14 | R3.2 64.56,14.64 63.88,13.97
VIN
  Bottom 0.813: C3.1 U4.1

### Text on the board
tPlace: an R-Pi / uploader / for AVR | ICSP | nRTS | 15321^3 | RPUBUS.ORG | RX | BOOTLOAD | TX | MISO / ACTIVE | 0V | TARGET VCC | ISP TARGET / HAS PWR / nRESET | nCTS | MOSI | TARGET VCC | 0V | SHUTDOWN / SW | MOSI / ACTIVE | nRTS / ACTIVE | AVR ICSP TARGET | BOOTLOAD TARGET
bPlace: ICSP | RPUBUS.ORG | nRST | SCK | MISO